# Altium schematic sheet inverter.SchDoc
size A3; SheetNumber: 2; SheetTotal: 2
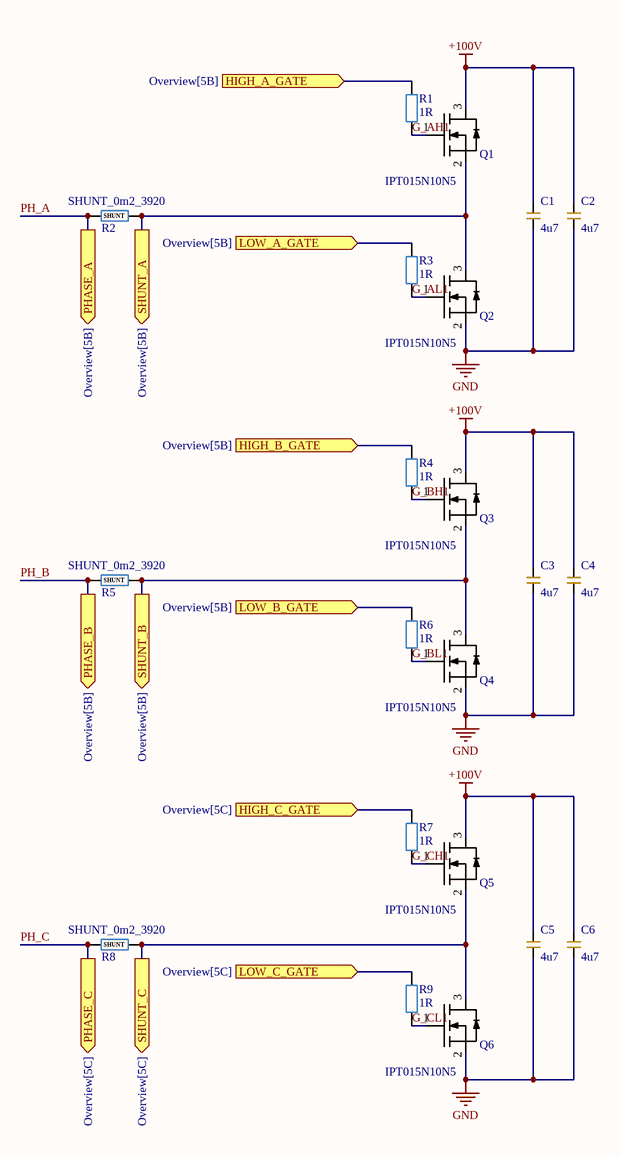
[diagram p0: inverter.SchDoc]

## Parts
C1  4u7  [FS32X475K101EGG]
C2  4u7  [FS32X475K101EGG]
C3  4u7  [FS32X475K101EGG]
C4  4u7  [FS32X475K101EGG]
C5  4u7  [FS32X475K101EGG]
C6  4u7  [FS32X475K101EGG]
Q1  IPT015N10N5  [IPT015N10N5]
Q2  IPT015N10N5  [IPT015N10N5]
Q3  IPT015N10N5  [IPT015N10N5]
Q4  IPT015N10N5  [IPT015N10N5]
Q5  IPT015N10N5  [IPT015N10N5]
Q6  IPT015N10N5  [IPT015N10N5]
R1  1R  [RES_0805]
R2  SHUNT_0m2_3920  [ASR-M-5-0.2F-t1]
R3  1R  [RES_0805]
R4  1R  [RES_0805]
R5  SHUNT_0m2_3920  [ASR-M-5-0.2F-t1]
R6  1R  [RES_0805]
R7  1R  [RES_0805]
R8  SHUNT_0m2_3920  [ASR-M-5-0.2F-t1]
R9  1R  [RES_0805]

## Ports
HIGH_A_GATE (in, see Overview[5B]), HIGH_B_GATE (in, see Overview[5B]), HIGH_C_GATE (in, see Overview[5C]), LOW_A_GATE (in, see Overview[5B]), LOW_B_GATE (in, see Overview[5B]), LOW_C_GATE (in, see Overview[5C]), PHASE_A (out, see Overview[5B]), PHASE_B (out, see Overview[5B]), PHASE_C (out, see Overview[5C]), SHUNT_A (out, see Overview[5B]), SHUNT_B (out, see Overview[5B]), SHUNT_C (out, see Overview[5C])

## Nets
+100V: C1.2 C2.2 C3.2 C4.2 C5.2 C6.2 Q1.3 Q3.3 Q5.3
GND: C1.1 C2.1 C3.1 C4.1 C5.1 C6.1 Q2.2 Q4.2 Q6.2
G_AH1: Q1.1(G) R1.1
G_AL1: Q2.1(G) R3.1
G_BH1: Q3.1(G) R4.1
G_BL1: Q4.1(G) R6.1
G_CH1: Q5.1(G) R7.1
G_CL1: Q6.1(G) R9.1
HIGH_A_GATE: R1.2 ; port HIGH_A_GATE
HIGH_B_GATE: R4.2 ; port HIGH_B_GATE
HIGH_C_GATE: R7.2 ; port HIGH_C_GATE
LOW_A_GATE: R3.2 ; port LOW_A_GATE
LOW_B_GATE: R6.2 ; port LOW_B_GATE
LOW_C_GATE: R9.2 ; port LOW_C_GATE
PH_A: R2.1 ; port PHASE_A
PH_B: R5.1 ; port PHASE_B
PH_C: R8.1 ; port PHASE_C
SHUNT_A: Q1.2 Q2.3 R2.2 ; port SHUNT_A
SHUNT_B: Q3.2 Q4.3 R5.2 ; port SHUNT_B
SHUNT_C: Q5.2 Q6.3 R8.2 ; port SHUNT_C

## Notes on the sheet
- (in symbol SHUNT_0m2_3920) SHUNT

## Library data of the parts
C1-C6 = 4u7: 100V 4.7uF X7R ±10% 1210 Multilayer Ceramic Capacitors MLCC - SMD/SMT ROHS; Mfr.: PSA(Prosperity Dielectrics); Voltage Rating: 100V; Package: 1210; LCSC: C381466; Mfr. Part: FS32X475K101EGG
Q1-Q6 = IPT015N10N5: 100V 500A 533W 1.35mΩ 1 N-channel HSOF-8 MOSFETs ROHS; Mfr.: Tokmas; LCSC: C19626223; Mfr. Part: IPT015N10N5
R1 R3 R4 R6 R7 R9 = RES_0805: Resistor SMD 0805 Generic; Mfr.: *; Voltage Rating: *; Mfr. Part: *; Package: 0805; LCSC: *; Power Rating: *
R2 R5 R8 = SHUNT_0m2_3920: 12W 0.2mΩ Patch Splitter ±200ppm/℃ ±1% 3920 Current Sense Resistors / Shunt Resistors ROHS; Mfr.: Shenzhen Yezhan Elec.; Mfr. Part: ASR-M-5-0.2F-t1; LCSC: C469432